# EAGLE design ENC_card (EAGLE 6.3)
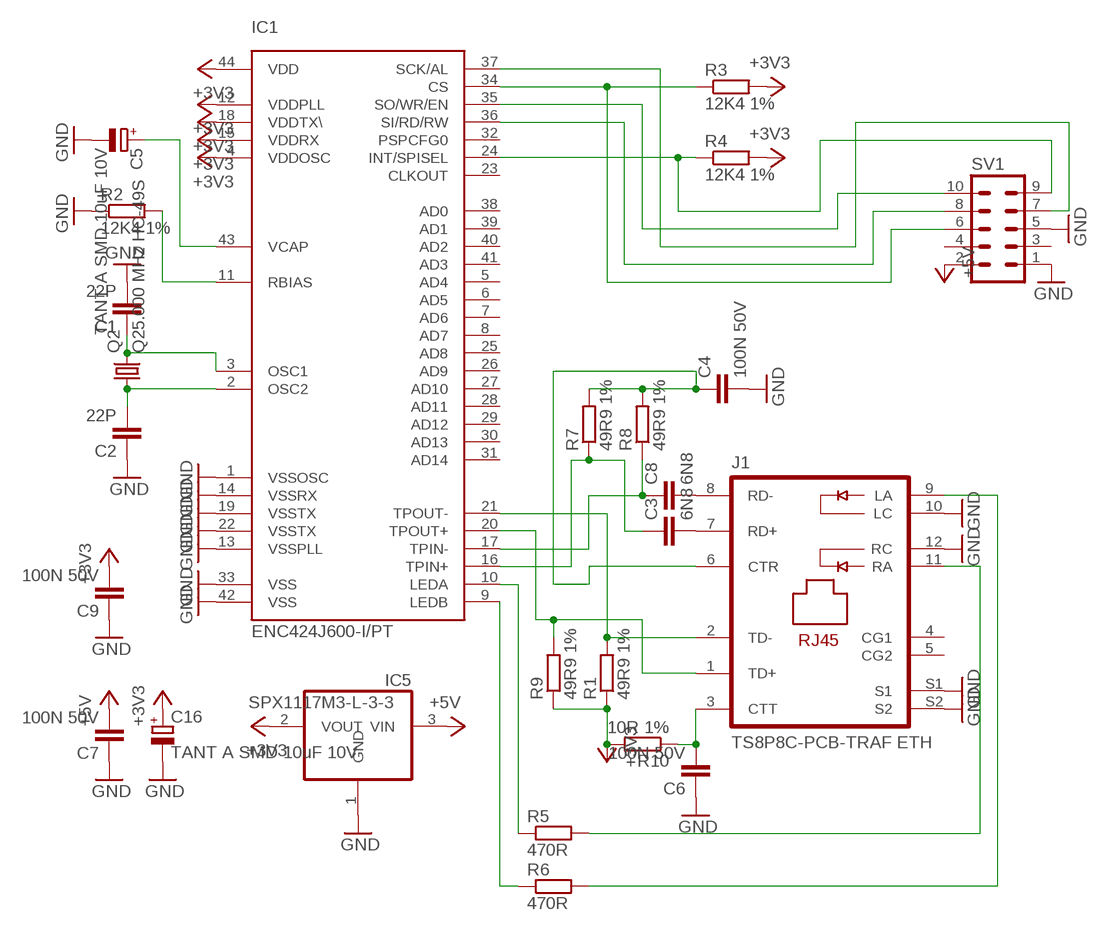
[diagram p0: schematic, sheet 1]

## Parts
C1  22P  C-EUC0805  [C0805]
C2  22P  C-EUC0805  [C0805]
C3  6N8  C-EUC0805  [C0805]
C4  100N 50V  C-EUC0805  [C0805]
C5  TANT A SMD 10uF 10V  CPOL-EUSMCA  [SMC_A]
C6  100N 50V  C-EUC0805  [C0805]
C7  100N 50V  C-EUC0805  [C0805]
C8  6N8  C-EUC0805  [C0805]
C9  100N 50V  C-EUC0805  [C0805]
C16  TANT A SMD 10uF 10V  CPOL-EUSMCA  [SMC_A]
IC1  ENC424J600-I/PT  [TQFP44]
IC5  SPX1117M3-L-3-3  REG1117  [SOT223]
J1  TS8P8C-PCB-TRAF ETH  J0026  [PJ-J0]
Q2  Q25.000 MHz HC-49S  CRYSTALHC49S  [HC49/S]
R1  49R9 1%  R-EU_R0805  [R0805]
R2  12K4 1%  R-EU_R0805  [R0805]
R3  12K4 1%  R-EU_R0805  [R0805]
R4  12K4 1%  R-EU_R0805  [R0805]
R5  470R  R-EU_R0805  [R0805]
R6  470R  R-EU_R0805  [R0805]
R7  49R9 1%  R-EU_R0805  [R0805]
R8  49R9 1%  R-EU_R0805  [R0805]
R9  49R9 1%  R-EU_R0805  [R0805]
R10  10R 1%  R-EU_R0805  [R0805]
SV1  ML10L  [ML10L]

## Nets
+3V3: C9.2 C16.+ IC1.4(VDDOSC) IC1.12(VDDPLL) IC1.15(VDDRX) IC1.18(VDDTX\) IC1.44(VDD) IC5.2(VOUT) R1.1 R3.2 R4.2 R9.1 R10.2
+5V: C7.2 IC5.3(VIN) SV1.2
GND: C1.2 C2.1 C4.2 C5.- C6.1 C7.1 C9.1 C16.- IC1.1(VSSOSC) IC1.13(VSSPLL) IC1.14(VSSRX) IC1.19(VSSTX) IC1.22(VSSTX) IC1.33(VSS) IC1.42(VSS) IC5.1(GND) J1.10(LC) J1.12(RC) J1.S1 J1.S2 R2.1 SV1.1 SV1.5
N$1: IC1.24(INT/SPISEL) R4.1 SV1.9
N$2: C8.2 J1.8(RD-)
N$3: C2.2 IC1.2(OSC2) Q2.1
N$4: C1.1 IC1.3(OSC1) Q2.2
N$5: C3.2 J1.7(RD+)
N$8: IC1.11(RBIAS) R2.2
N$11: C5.+ IC1.43(VCAP)
N$13: IC1.34(CS) R3.1 SV1.6
N$14: IC1.37(SCK/AL) SV1.7
N$15: IC1.36(SI/RD/RW) SV1.8
N$16: IC1.35(SO/WR/EN) SV1.10
N$21: J1.11(RA) R5.2
N$22: J1.9(LA) R6.2
N$31: C6.2 J1.3(CTT) R10.1
N$34: IC1.21(TPOUT-) J1.2(TD-) R1.2
N$35: IC1.20(TPOUT+) J1.1(TD+) R9.2
N$38: C4.1 J1.6(CTR) R7.2 R8.2
N$39: C8.1 IC1.17(TPIN-) R8.1
N$40: C3.1 IC1.16(TPIN+) R7.1
N$59: IC1.10(LEDA) R5.1
N$60: IC1.9(LEDB) R6.1
Unconnected: IC1.5(AD4) IC1.6(AD5) IC1.7(AD6) IC1.8(AD7) IC1.23(CLKOUT) IC1.25(AD8) IC1.26(AD9) IC1.27(AD10) IC1.28(AD11) IC1.29(AD12) IC1.30(AD13) IC1.31(AD14) IC1.32(PSPCFG0) IC1.38(AD0) IC1.39(AD1) IC1.40(AD2) IC1.41(AD3) J1.4(CG1) J1.5(CG2) SV1.3 SV1.4

## Library data of the parts
C1-C4 C6-C9 = rcl:C-EU: CAPACITOR, European symbol
C5 C16 = rcl:CPOL-EU: POLARIZED CAPACITOR, European symbol
IC1 = microchip-ethernet:ENC424J600: Stand-Alone 10/100 Ethernet Controller with SPI or Parallel Interface The ENC424J600 and ENC624J600 are stand-alone,Fast Ethernet controllers with an industry standard Serial Peripheral Interface (SPI) or a flexible parallel interface. They are designed to serve as an Ethernet network interface for any microcontroller equipped with SPI or a standard parallel port. ENC424J600/624J600 devices meet all of the IEEE 802.3 specifications applicable to 10Base-T and 100Base-TX Ethernet, including many optional clauses, such as auto-negotiation. They incorporate a number of packet filtering schemes to limit incoming packets. They also provide an internal, 16-bit wide DMA for fast data throughput and support for hardware IP checksum calculations. For applications that require the security and authentication features of SSL, TLS and other protocols related to cryptography, a block of security engines is provided. The engines perform RSA, Diffie-Hellman, AES, MD5 and SHA-1 algorithm computations, allowing reduced code size, faster connection establishment and throughput, and reduced firmware development effort.
IC5 = burr-brown:REG1117: 800mA and 1A Low Dropout (LDO) Positive Regulator 1.8V, 2.5V, 2.85V, 3.3V, 5V, and Adj; MPN: REG1117; OC_FARNELL: 1097566; OC_NEWARK: 14P6981
J1 = con-pulse:J0026: RJ45 PulseJack w/LEDs
Q2 = crystal:CRYSTAL: CRYSTAL; OC_FARNELL: 1667008; OC_NEWARK: unknown
R1-R10 = rcl:R-EU_: RESISTOR, European symbol
SV1 = con-harting-ml:ML10: HARTING; OC_FARNELL: unknown; OC_NEWARK: unknown

## Board
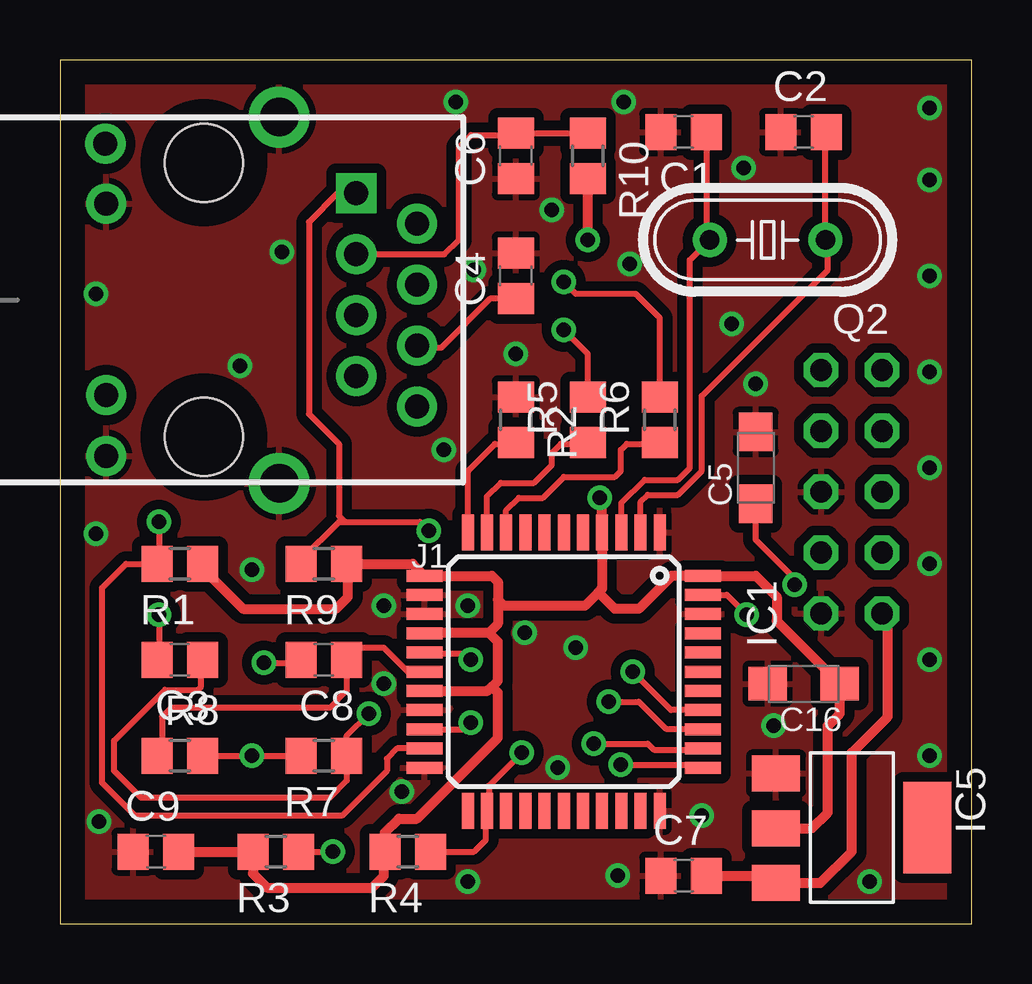
[diagram p1: board, top side]
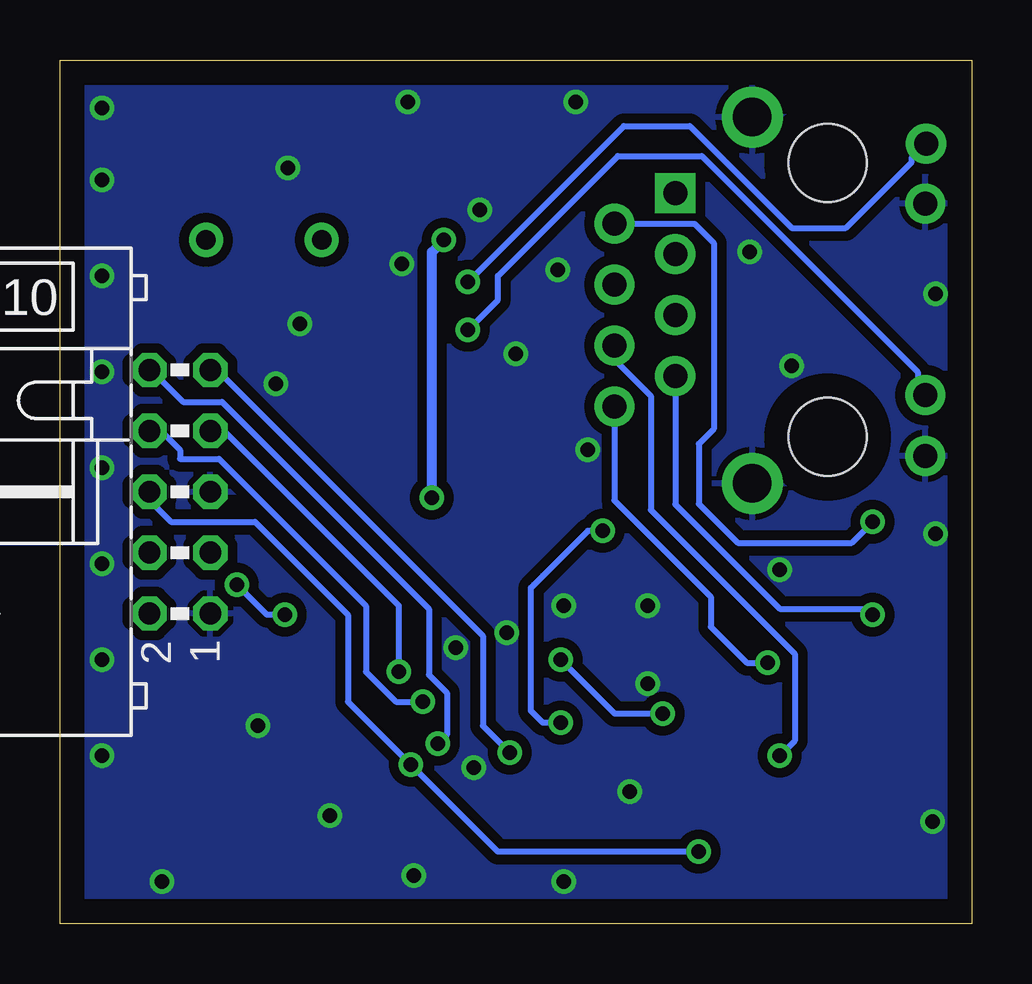
[diagram p2: board, bottom side, seen from below]

Size 38 x 36 mm. Coordinates in mm from the lower left corner, seen from the top.
Outline: 0,0 38,0 38,36 0,36 0,0
Copper layers (1*16): Top 0.035mm / dielectric 1.5mm / Bottom 0.035mm
Design rules "default": minimum track width 10mil, minimum drill 24mil, track to track 8mil, track to pad 8mil, pad to pad 8mil, via to via 8mil, smd to smd 8mil, copper to edge 40mil, drill to drill 8mil, minimum pad ring 10mil, minimum via ring 8mil, stop-mask expansion 4mil, vias tented up to drill 0mil, thermal gap 10mil

### Footprints (pad centres in the part's own frame; a part is rotated, then mirrored left to right if it is on the bottom)
C0805 = smd 1.3 x 1.5: 1 -0.95,0; 2 0.95,0
SMC_A = smd 1.6 x 1.4: + -1.5,0; - 1.5,0
TQFP44 = smd 1.5 x 0.5: 1 -5.8,4; 2 -5.8,3.2; 3 -5.8,2.4; 4 -5.8,1.6; 5 -5.8,0.8; 6 -5.8,0; 7 -5.8,-0.8; 8 -5.8,-1.6; 9 -5.8,-2.4; 10 -5.8,-3.2; 11 -5.8,-4; 23 5.8,-4; 24 5.8,-3.2; 25 5.8,-2.4; 26 5.8,-1.6; 27 5.8,-0.8; 28 5.8,0; 29 5.8,0.8; 30 5.8,1.6; 31 5.8,2.4; 32 5.8,3.2; 33 5.8,4 | smd 0.5 x 1.5: 12 -4,-5.8; 13 -3.2,-5.8; 14 -2.4,-5.8; 15 -1.6,-5.8; 16 -0.8,-5.8; 17 0,-5.8; 18 0.8,-5.8; 19 1.6,-5.8; 20 2.4,-5.8; 21 3.2,-5.8; 22 4,-5.8; 34 4,5.8; 35 3.2,5.8; 36 2.4,5.8; 37 1.6,5.8; 38 0.8,5.8; 39 0,5.8; 40 -0.8,5.8; 41 -1.6,5.8; 42 -2.4,5.8; 43 -3.2,5.8; 44 -4,5.8
SOT223 = smd 1.499 x 2.007: 1 -2.261,-3.15; 2 0.025,-3.15; 3 2.311,-3.15 | smd 3.81 x 2.007: 4 0,3.15
PJ-J0 = drill 1 pad 1.676 square: 1 -4.445,6.35 | drill 1 pad 1.676: 2 -3.175,8.89; 3 -1.905,6.35; 4 -0.635,8.89; 5 0.635,6.35; 6 1.905,8.89; 7 3.175,6.35; 8 4.445,8.89; 9 -6.515,-4.109; 10 -4.007,-4.077; 11 3.969,-4.077; 12 6.509,-4.077 | drill 1.6 pad 2.54: S1 7.652,3.143; S2 -7.62,3.143 | hole 3.251: -5.715,0; 5.715,0
HC49/S = drill 0.813 pad 1.422: 1 -2.413,0; 2 2.413,0
R0805 = smd 1.3 x 1.5: 1 -0.95,0; 2 0.95,0
ML10L = drill 0.914 octagon: 1 -5.08,-1.27; 2 -5.08,1.27; 3 -2.54,-1.27; 4 -2.54,1.27; 5 0,-1.27; 6 0,1.27; 7 2.54,-1.27; 8 2.54,1.27; 9 5.08,-1.27; 10 5.08,1.27

### Placement (x,y rotation side)
C1  26,33 180 top
C2  31,33 0 top
C3  5,11 180 top
C4  19,27 90 top
C5  29,19 90 top
C6  19,32 90 top
C7  26,2 0 top
C8  11,11 180 top
C9  4,3 0 top
C16  31,10 180 top
IC1  21,10.5 270 top
IC5  33,4 270 top
J1  6,26 270 top
Q2  29.5,28.5 180 top
R1  5,15 180 top
R2  19,21 270 top
R3  9,3 180 top
R4  14.5,3 180 top
R5  22,21 90 top
R6  25,21 90 top
R7  11,7 180 top
R8  5,7 0 top
R9  11,15 180 top
R10  22,32 270 top
SV1  33,18 90 bottom

### Tracks (layer width: path | path; a pad name or v marks a point on that pad's centre or on a via)
+3V3  (via drill 0.6)
  Top 0.406: IC5.2 31.35,3.98 32,4.62 32,8.25 32.5,8.75 C16.+ 29.88,12.62 29.88,13.62 29,14.5 IC1.44 25.5,14.5 24.12,13.12 23.12,13.12 22.44,13.81 | 18.25,13.5 18.25,14.25 18,14.5 IC1.12 14.7,15 R9.1 12,14.95 12,13.62 11.5,13.12 7.62,13.12 5.95,14.8 R1.1 | 18.25,13.5 18.25,12.5 17.88,12.12 | 17.88,12.12 15.22,12.12 IC1.15 | IC1.18 17.82,9.7 18,9.88 | 18,9.88 18.25,10.12 18.25,11.75 17.88,12.12 | 22.44,13.81 22.6,13.97 IC1.4 22.6,17.65 v22.5,17.75 | 22.44,13.81 21.88,13.25 18.5,13.25 18.25,13.5 | 18,9.88 18.25,9.62 18.25,7.75 14.88,4.38 14.12,4.38 13.55,3.8 R4.2 13.5,2.95 13.5,2 13,1.5 8.62,1.5 8.05,2.08 R3.2 C9.2 | v22,28.5 R10.2
  Bottom 0.406: v22.5,17.75 22.5,28 v22,28.5
+5V
  Top 0.406: C7.2 29.85,2 IC5.3 31.69,1.69 33,3 33,7.12 34.5,8.62 34.5,12.69 SV1.2
GND  (via drill 0.6)
  other vias: 13.5,13.25 8,14.75 20.75,6.5 14.25,5.5 13.5,10 17,13.25 21.5,11.5 16,19.75 19,23.75 28,25 23.75,27.5 29,22.5 17.25,27.25 20.5,29.75 28.5,31.5 23.5,34.25 9.25,28 23.25,2 17,1.75 26.75,4.5 29.75,8.25 33.75,1.75 36.25,7 36.25,11 36.25,15 36.25,19 36.25,23 36.25,27 36.25,31 36.25,34 16.5,34.25 1.5,26.25 7.5,23.25 1.5,16.25 19.38,12.12 1.62,4.25
  pour Top (isolate 0.406): 0.5,0.5 37.5,0.5 37.5,2.5 37.5,35.5 0.5,35.5
  pour Bottom (isolate 0.406): 0.5,35.5 37.5,35.5 37.5,16.5 37.5,0.5 0.5,0.5 0.5,4
N$1  (via drill 0.6)
  Top 0.254: v19.25,7.12 17.88,5.75 17.88,4.78 IC1.24 17.75,4.65 17.75,3.5 17.25,3 R4.1
  Bottom 0.254: SV1.9 31.73,23.36 20.38,12 20.38,8.25 v19.25,7.12
N$2  (via drill 0.6)
  Top 0.254: v8.5,10.88 9.93,10.88 C8.2
  Bottom 0.254: J1.8 14.89,17.64 10.88,13.62 10.88,12.38 9.38,10.88 v8.5,10.88
N$3
  Top 0.254: IC1.2 24.2,17.57 24.5,17.88 25.75,17.88 26.75,18.88 26.75,22 32,27.25 32,28.41 Q2.1 31.91,32.96 C2.2
N$4
  Top 0.254: C1.1 26.95,28.64 Q2.2 | IC1.3 23.4,17.52 24.38,18.5 25.75,18.5 26.25,19 26.25,27.66 Q2.2 | 26.88,28.29 Q2.2
N$5  (via drill 0.6)
  Top 0.254: v4.12,12.88 4.12,11.07 C3.2
  Bottom 0.254: J1.7 12.35,17.48 8,13.12 4.38,13.12 v4.12,12.88
N$8
  Top 0.254: IC1.11 17,18.88 18.12,20 18.95,20 R2.2
N$11  (via drill 0.6)
  Top 0.254: IC1.43 27.8,13.7 v28.62,12.88 | v30.62,14.12 30.62,14.38 29,16 C5.+
  Bottom 0.254: v28.62,12.88 29.38,12.88 v30.62,14.12
N$13  (via drill 0.6)
  Top 0.254: v23.38,6.62 26.68,6.62 IC1.34 | R3.1 v11.38,3
  Bottom 0.254: SV1.6 34.27,17.64 33.38,16.75 29.88,16.75 26,12.88 26,9.25 v23.38,6.62 19.75,3 v11.38,3
N$14  (via drill 0.6)
  Top 0.254: IC1.37 25.48,8.9 v23.88,10.5
  Bottom 0.254: v23.88,10.5 23.88,13.25 31.12,20.5 31.69,20.5 SV1.7
N$15  (via drill 0.6)
  Top 0.254: v22.88,9.25 24.12,9.25 25.25,8.12 26.77,8.12 IC1.36
  Bottom 0.254: SV1.8 33.79,20.54 33,19.75 33,19.38 31.38,19.38 25.25,13.25 25.25,10.5 24,9.25 v22.88,9.25
N$16  (via drill 0.6)
  Top 0.254: v22.25,7.5 24.5,7.5 24.75,7.25 26.75,7.25 IC1.35
  Bottom 0.254: SV1.10 34.2,23.08 32.88,21.75 31.25,21.75 22.62,13.12 22.62,10.38 21.88,9.62 21.88,7.88 v22.25,7.5
N$21  (via drill 0.6)
  Top 0.254: R5.2 22,23.75 v21,24.75
  Bottom 0.254: v21,24.75 19.75,26 19.75,27 14.75,32 11.25,32 2.25,23 2.25,22.36 J1.11
N$22  (via drill 0.6)
  Top 0.254: R6.2 25,25.25 24,26.25 21.5,26.25 v21,26.75
  Bottom 0.254: v21,26.75 14.5,33.25 11.75,33.25 7.5,29 5.25,29 2.5,31.75 2.5,31.91 J1.9
N$31
  Top 0.254: J1.3 16.03,27.91 16.62,28.5 16.62,32.38 17.12,32.88 18.93,32.88 C6.2 R10.1
N$34  (via drill 0.6)
  Top 0.254: IC1.21 14.05,7.3 13.62,6.88 13.62,6.38 11.75,4.5 3.12,4.5 1.75,5.88 1.75,14 2.75,15 R1.2 4.12,15.07 v4.12,16.75
  Bottom 0.254: J1.2 11.55,29.18 10.75,28.38 10.75,20.62 11.38,20 11.38,17.5 9.75,15.88 5,15.88 v4.12,16.75
N$35  (via drill 0.6)
  Top 0.254: IC1.20 16.85,8.1 v17.12,8.38 | R9.2 10.05,15.18 11.62,16.75 11.88,16.75 | 11.88,16.75 15,16.75 v15.38,16.38 | J1.1 11.57,30.45 10.38,29.25 10.38,21.25 11.62,20 11.62,17 11.88,16.75
  Bottom 0.254: v17.12,8.38 17.88,8.38 18.38,8.88 18.38,14 18.25,14.12 17.88,14.5 16,16.38 v15.38,16.38
N$38  (via drill 0.6)
  Top 0.254: C4.1 17.93,26.05 15.88,24 14.98,24 J1.6 | R8.2 v8,7 R7.2
  Bottom 0.254: v8,7 7.38,7.62 7.38,11.25 13.38,17.25 13.38,22 14.98,23.61 14.98,24 J1.6
N$39
  Top 0.254: 12.45,10.5 C8.1 | C8.1 11.95,9.7 11.25,9 4.62,9 4.25,8.62 4.25,7.2 R8.1 | IC1.17 14.5,10.5 13.5,11.5 12.45,11.5 C8.1
N$40  (via drill 0.6)
  Top 0.254: C3.1 5.88,10.93 5.88,9.88 5.75,9.75 4.38,9.75 2.25,7.62 2.25,6.38 3.38,5.25 11.25,5.25 11.95,5.95 R7.1 11.95,7.83 v12.88,8.75 | v17.12,11 17.12,11.25 15.25,11.25 IC1.16
  Bottom 0.254: v12.88,8.75 14.88,8.75 v17.12,11
N$59
  Top 0.254: IC1.10 17.8,17.8 18.38,18.38 19.75,18.38 20.5,19.12 20.5,19.62 20.88,20 21.95,20 R5.1
N$60
  Top 0.254: IC1.9 18.6,17.23 19.12,17.75 20.12,17.75 21,18.62 23.12,18.62 23.38,18.88 23.38,19.75 23.62,20 24.95,20 R6.1